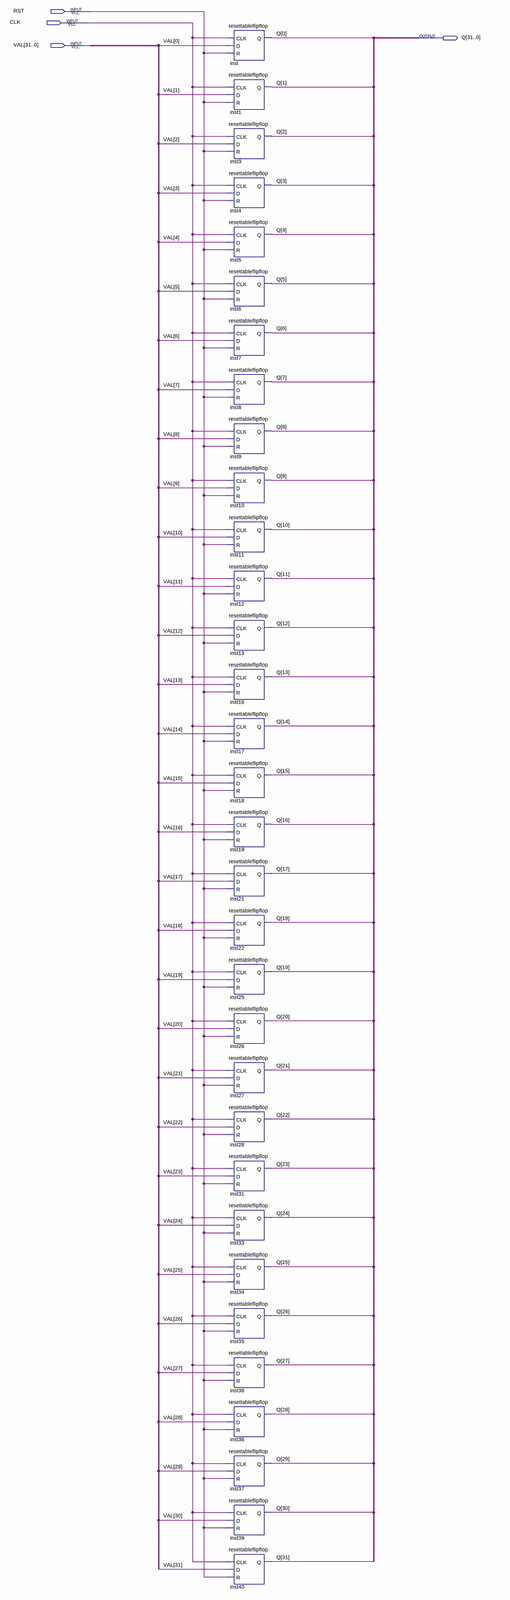
[diagram p0: schematic sheet, whole]
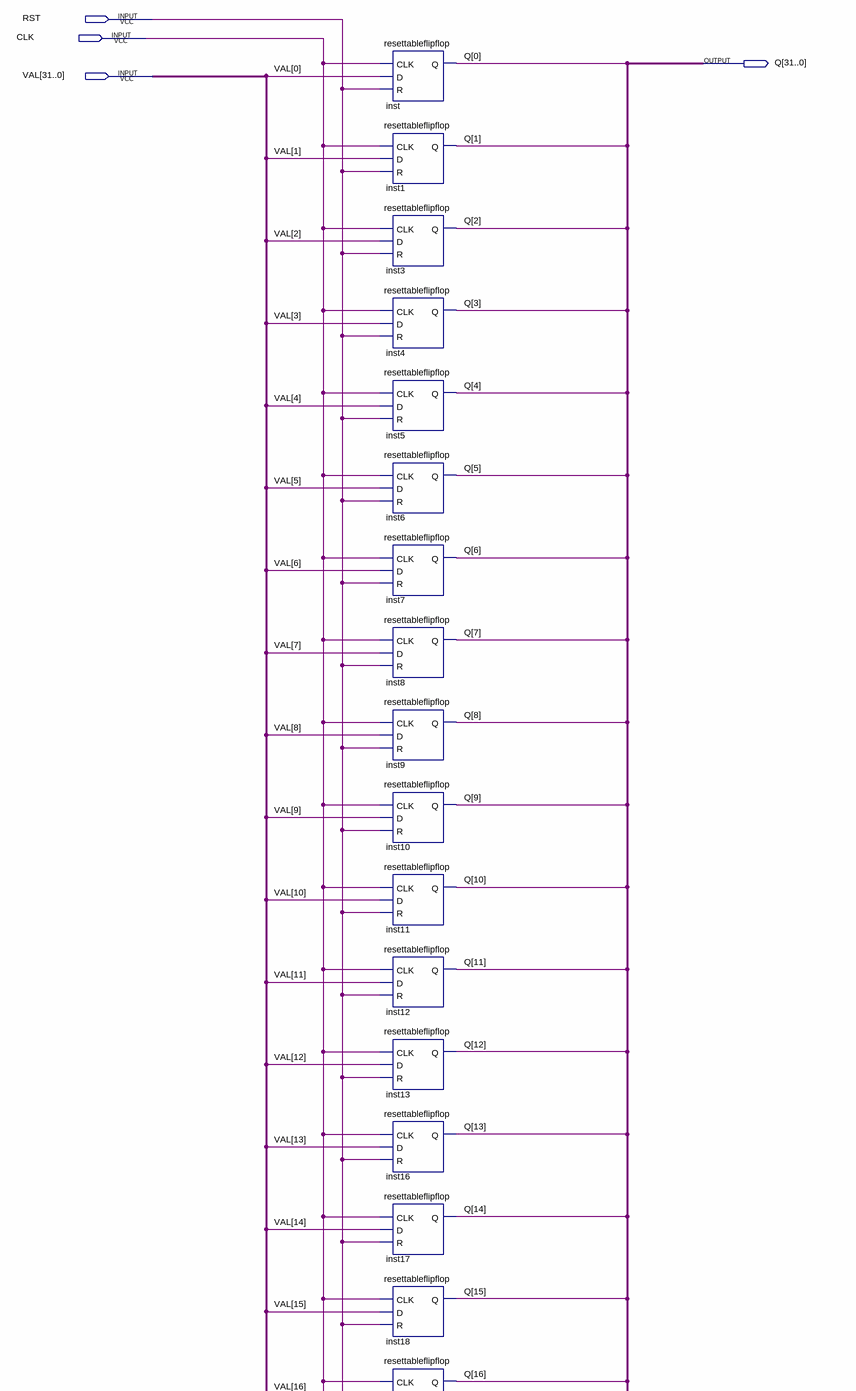
[diagram p1: schematic sheet, upper part]
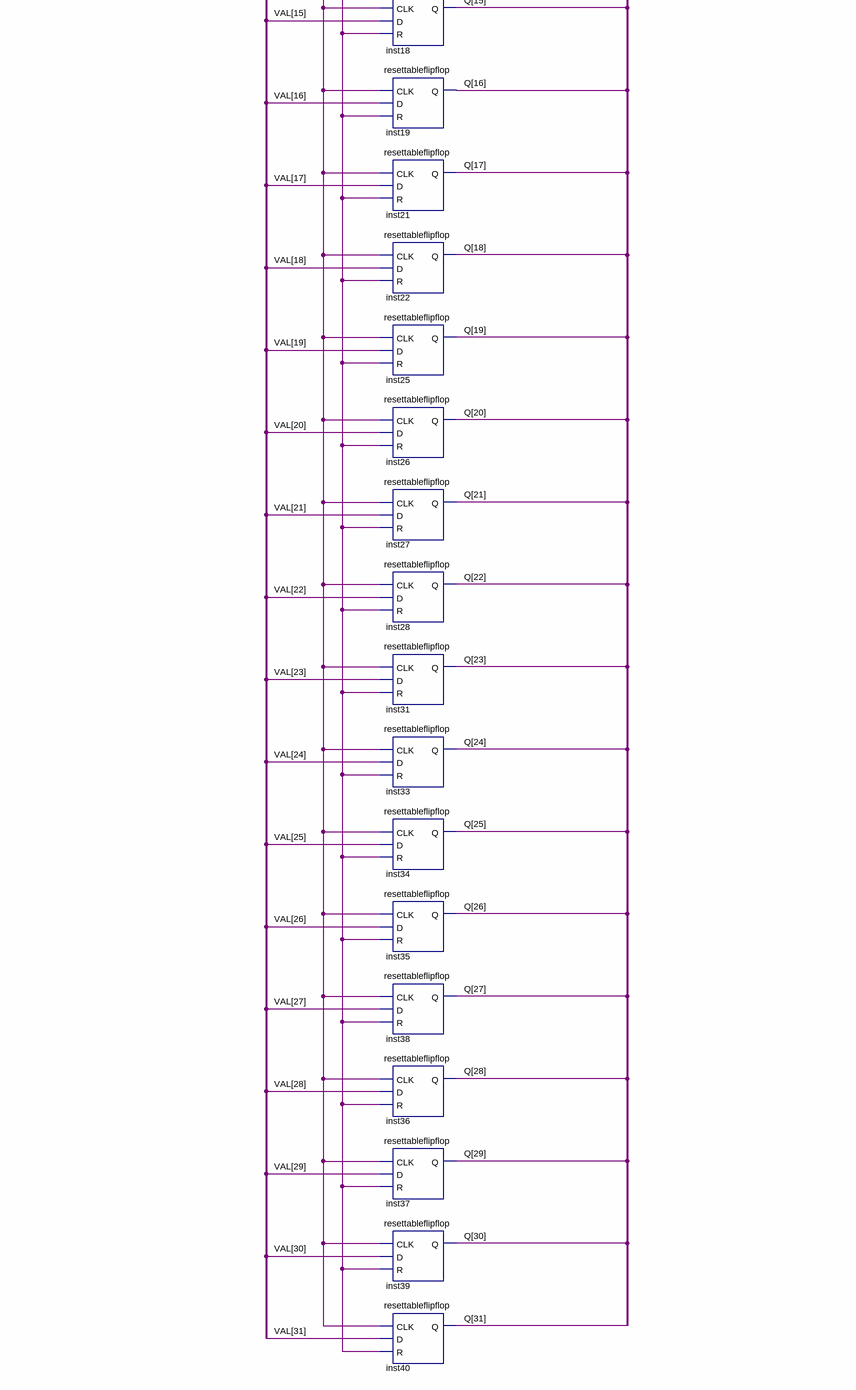
[diagram p2: schematic sheet, lower part]
// Quartus schematic programcounter.bdf as structural Verilog: 32 symbols, 4 pins
module programcounter (
  input  RST,
  input  CLK,
  input  [31:0] VAL,
  output [31:0] Q
);

  resettableflipflop inst (.CLK(CLK), .D(VAL[0]), .R(RST), .Q(Q[0]));
  resettableflipflop inst1 (.CLK(CLK), .D(VAL[1]), .R(RST), .Q(Q[1]));
  resettableflipflop inst3 (.CLK(CLK), .D(VAL[2]), .R(RST), .Q(Q[2]));
  resettableflipflop inst4 (.CLK(CLK), .D(VAL[3]), .R(RST), .Q(Q[3]));
  resettableflipflop inst5 (.CLK(CLK), .D(VAL[4]), .R(RST), .Q(Q[4]));
  resettableflipflop inst6 (.CLK(CLK), .D(VAL[5]), .R(RST), .Q(Q[5]));
  resettableflipflop inst7 (.CLK(CLK), .D(VAL[6]), .R(RST), .Q(Q[6]));
  resettableflipflop inst8 (.CLK(CLK), .D(VAL[7]), .R(RST), .Q(Q[7]));
  resettableflipflop inst9 (.CLK(CLK), .D(VAL[8]), .R(RST), .Q(Q[8]));
  resettableflipflop inst10 (.CLK(CLK), .D(VAL[9]), .R(RST), .Q(Q[9]));
  resettableflipflop inst11 (.CLK(CLK), .D(VAL[10]), .R(RST), .Q(Q[10]));
  resettableflipflop inst12 (.CLK(CLK), .D(VAL[11]), .R(RST), .Q(Q[11]));
  resettableflipflop inst13 (.CLK(CLK), .D(VAL[12]), .R(RST), .Q(Q[12]));
  resettableflipflop inst16 (.CLK(CLK), .D(VAL[13]), .R(RST), .Q(Q[13]));
  resettableflipflop inst17 (.CLK(CLK), .D(VAL[14]), .R(RST), .Q(Q[14]));
  resettableflipflop inst18 (.CLK(CLK), .D(VAL[15]), .R(RST), .Q(Q[15]));
  resettableflipflop inst19 (.CLK(CLK), .D(VAL[16]), .R(RST), .Q(Q[16]));
  resettableflipflop inst21 (.CLK(CLK), .D(VAL[17]), .R(RST), .Q(Q[17]));
  resettableflipflop inst22 (.CLK(CLK), .D(VAL[18]), .R(RST), .Q(Q[18]));
  resettableflipflop inst25 (.CLK(CLK), .D(VAL[19]), .R(RST), .Q(Q[19]));
  resettableflipflop inst26 (.CLK(CLK), .D(VAL[20]), .R(RST), .Q(Q[20]));
  resettableflipflop inst27 (.CLK(CLK), .D(VAL[21]), .R(RST), .Q(Q[21]));
  resettableflipflop inst28 (.CLK(CLK), .D(VAL[22]), .R(RST), .Q(Q[22]));
  resettableflipflop inst31 (.CLK(CLK), .D(VAL[23]), .R(RST), .Q(Q[23]));
  resettableflipflop inst33 (.CLK(CLK), .D(VAL[24]), .R(RST), .Q(Q[24]));
  resettableflipflop inst34 (.CLK(CLK), .D(VAL[25]), .R(RST), .Q(Q[25]));
  resettableflipflop inst35 (.CLK(CLK), .D(VAL[26]), .R(RST), .Q(Q[26]));
  resettableflipflop inst38 (.CLK(CLK), .D(VAL[27]), .R(RST), .Q(Q[27]));
  resettableflipflop inst36 (.CLK(CLK), .D(VAL[28]), .R(RST), .Q(Q[28]));
  resettableflipflop inst37 (.CLK(CLK), .D(VAL[29]), .R(RST), .Q(Q[29]));
  resettableflipflop inst39 (.CLK(CLK), .D(VAL[30]), .R(RST), .Q(Q[30]));
  resettableflipflop inst40 (.CLK(CLK), .D(VAL[31]), .R(RST), .Q(Q[31]));
endmodule
